# EAGLE design ultimate_Co-Op_v1_0 (EAGLE 7.4.0)
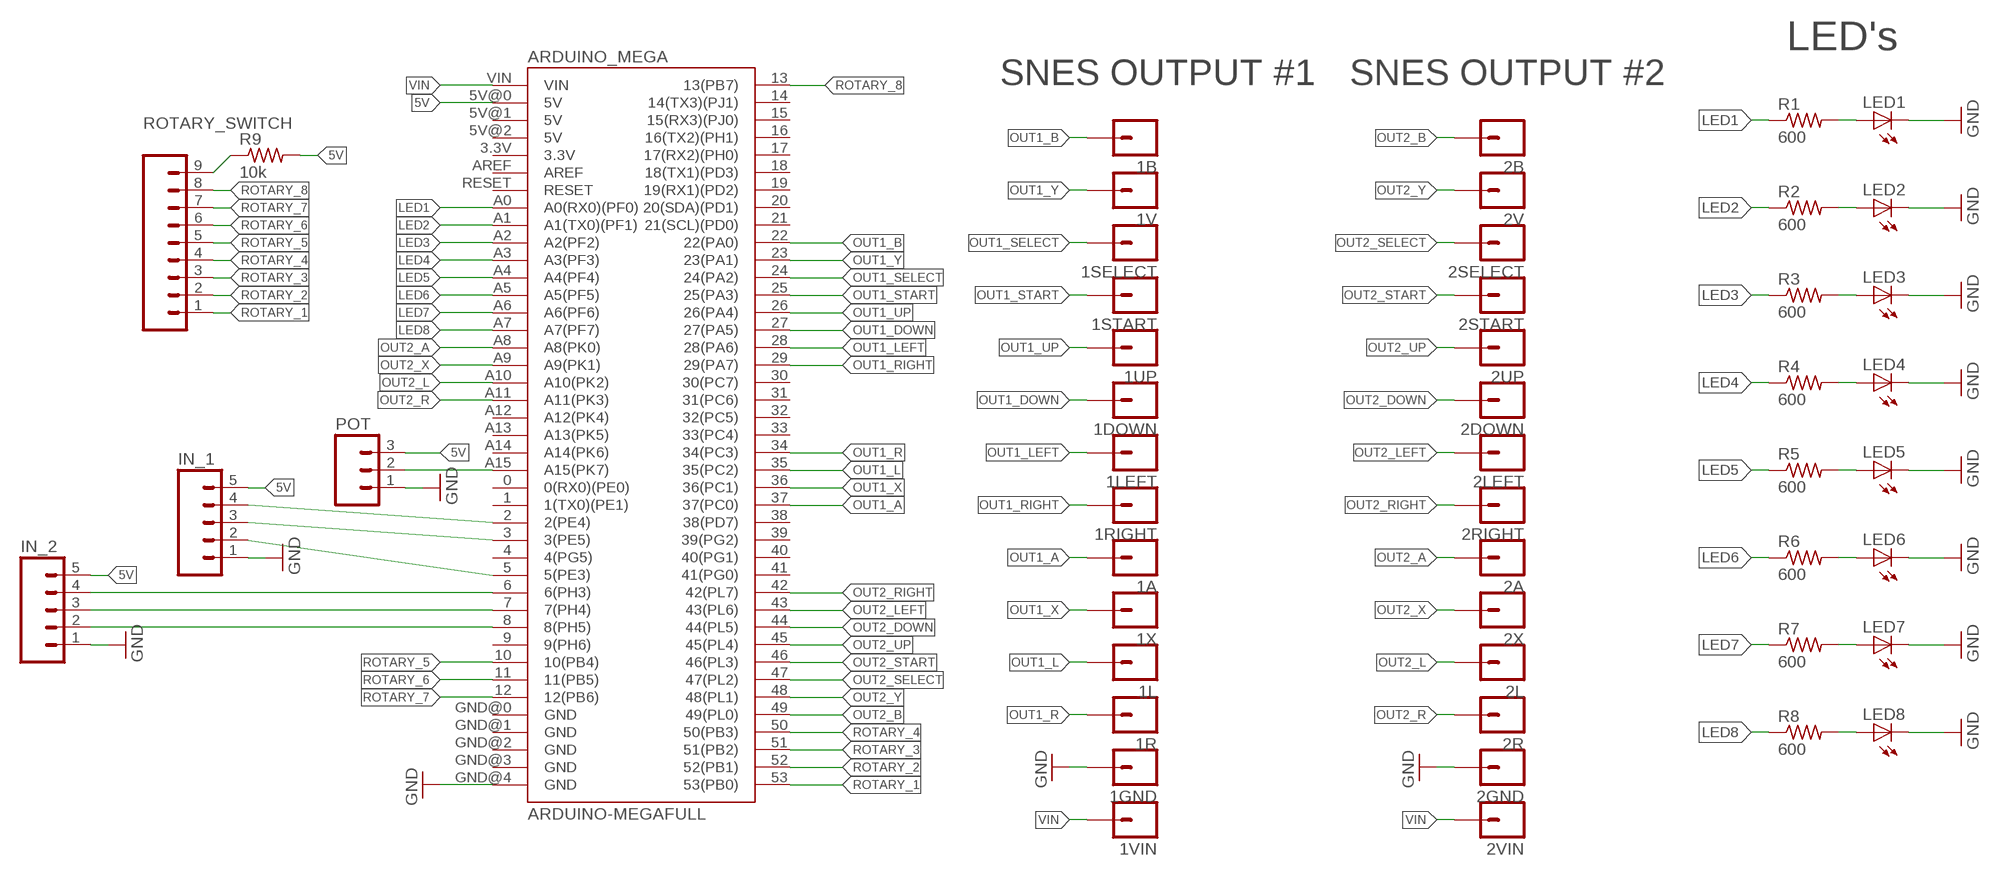
[diagram p0: schematic, sheet 1]

## Parts
1A  M01PTH  [1X01]
1B  M01PTH  [1X01]
1DOWN  M01PTH  [1X01]
1GND  M01PTH  [1X01]
1L  M01PTH  [1X01]
1LEFT  M01PTH  [1X01]
1R  M01PTH  [1X01]
1RIGHT  M01PTH  [1X01]
1SELECT  M01PTH  [1X01]
1START  M01PTH  [1X01]
1UP  M01PTH  [1X01]
1V  M01PTH  [1X01]
1VIN  M01PTH  [1X01]
1X  M01PTH  [1X01]
2A  M01PTH  [1X01]
2B  M01PTH  [1X01]
2DOWN  M01PTH  [1X01]
2GND  M01PTH  [1X01]
2L  M01PTH  [1X01]
2LEFT  M01PTH  [1X01]
2R  M01PTH  [1X01]
2RIGHT  M01PTH  [1X01]
2SELECT  M01PTH  [1X01]
2START  M01PTH  [1X01]
2UP  M01PTH  [1X01]
2V  M01PTH  [1X01]
2VIN  M01PTH  [1X01]
2X  M01PTH  [1X01]
ARDUINO_MEGA  ARDUINO-MEGAFULL  [ARDUINO_MEGA]
IN_1  M05PTH  [1X05]
IN_2  M05PTH  [1X05]
LED1  LED5MM  [LED5MM]
LED2  LED5MM  [LED5MM]
LED3  LED5MM  [LED5MM]
LED4  LED5MM  [LED5MM]
LED5  LED5MM  [LED5MM]
LED6  LED5MM  [LED5MM]
LED7  LED5MM  [LED5MM]
LED8  LED5MM  [LED5MM]
POT  M03LONGPADS  [1X03_LONGPADS]
R1  600  R-US_0204/7  [0204/7]
R2  600  R-US_0204/7  [0204/7]
R3  600  R-US_0204/7  [0204/7]
R4  600  R-US_0204/7  [0204/7]
R5  600  R-US_0204/7  [0204/7]
R6  600  R-US_0204/7  [0204/7]
R7  600  R-US_0204/7  [0204/7]
R8  600  R-US_0204/7  [0204/7]
R9  10k  R-US_0204/7  [0204/7]
ROTARY_SWITCH  M09  [1X09]

## Nets
5V: ARDUINO_MEGA.5V@0(5V) IN_1.5 IN_2.5 POT.3 R9.2
GND: 1GND.1 2GND.1 ARDUINO_MEGA.GND@4(GND) IN_1.1 IN_2.1 LED1.K(C) LED2.K(C) LED3.K(C) LED4.K(C) LED5.K(C) LED6.K(C) LED7.K(C) LED8.K(C) POT.1
LED1: ARDUINO_MEGA.A0(A0(RX0)(PF0)) R1.1
LED2: ARDUINO_MEGA.A1(A1(TX0)(PF1)) R2.1
LED3: ARDUINO_MEGA.A2(A2(PF2)) R3.1
LED4: ARDUINO_MEGA.A3(A3(PF3)) R4.1
LED5: ARDUINO_MEGA.A4(A4(PF4)) R5.1
LED6: ARDUINO_MEGA.A5(A5(PF5)) R6.1
LED7: ARDUINO_MEGA.A6(A6(PF6)) R7.1
LED8: ARDUINO_MEGA.A7(A7(PF7)) R8.1
LSJDFKS: ARDUINO_MEGA.6(6(PH3)) IN_2.4
N$1: LED1.A R1.2
N$2: LED2.A R2.2
N$3: LED3.A R3.2
N$4: LED4.A R4.2
N$5: LED5.A R5.2
N$6: LED6.A R6.2
N$7: LED7.A R7.2
N$8: LED8.A R8.2
N$9: ARDUINO_MEGA.2(2(PE4)) IN_1.4
N$10: ARDUINO_MEGA.3(3(PE5)) IN_1.3
N$11: ARDUINO_MEGA.5(5(PE3)) IN_1.2
N$13: ARDUINO_MEGA.7(7(PH4)) IN_2.3
N$14: ARDUINO_MEGA.8(8(PH5)) IN_2.2
OIJNENLK: R9.1 ROTARY_SWITCH.9
OUT1_A: 1A.1 ARDUINO_MEGA.37(37(PC0))
OUT1_B: 1B.1 ARDUINO_MEGA.22(22(PA0))
OUT1_DOWN: 1DOWN.1 ARDUINO_MEGA.27(27(PA5))
OUT1_L: 1L.1 ARDUINO_MEGA.35(35(PC2))
OUT1_LEFT: 1LEFT.1 ARDUINO_MEGA.28(28(PA6))
OUT1_R: 1R.1 ARDUINO_MEGA.34(34(PC3))
OUT1_RIGHT: 1RIGHT.1 ARDUINO_MEGA.29(29(PA7))
OUT1_SELECT: 1SELECT.1 ARDUINO_MEGA.24(24(PA2))
OUT1_START: 1START.1 ARDUINO_MEGA.25(25(PA3))
OUT1_UP: 1UP.1 ARDUINO_MEGA.26(26(PA4))
OUT1_X: 1X.1 ARDUINO_MEGA.36(36(PC1))
OUT1_Y: 1V.1 ARDUINO_MEGA.23(23(PA1))
OUT2_A: 2A.1 ARDUINO_MEGA.A8(A8(PK0))
OUT2_B: 2B.1 ARDUINO_MEGA.49(49(PL0))
OUT2_DOWN: 2DOWN.1 ARDUINO_MEGA.44(44(PL5))
OUT2_L: 2L.1 ARDUINO_MEGA.A10(A10(PK2))
OUT2_LEFT: 2LEFT.1 ARDUINO_MEGA.43(43(PL6))
OUT2_R: 2R.1 ARDUINO_MEGA.A11(A11(PK3))
OUT2_RIGHT: 2RIGHT.1 ARDUINO_MEGA.42(42(PL7))
OUT2_SELECT: 2SELECT.1 ARDUINO_MEGA.47(47(PL2))
OUT2_START: 2START.1 ARDUINO_MEGA.46(46(PL3))
OUT2_UP: 2UP.1 ARDUINO_MEGA.45(45(PL4))
OUT2_X: 2X.1 ARDUINO_MEGA.A9(A9(PK1))
OUT2_Y: 2V.1 ARDUINO_MEGA.48(48(PL1))
POT1: ARDUINO_MEGA.A15(A15(PK7)) POT.2
ROTARY_1: ARDUINO_MEGA.53(53(PB0)) ROTARY_SWITCH.1
ROTARY_2: ARDUINO_MEGA.52(52(PB1)) ROTARY_SWITCH.2
ROTARY_3: ARDUINO_MEGA.51(51(PB2)) ROTARY_SWITCH.3
ROTARY_4: ARDUINO_MEGA.50(50(PB3)) ROTARY_SWITCH.4
ROTARY_5: ARDUINO_MEGA.10(10(PB4)) ROTARY_SWITCH.5
ROTARY_6: ARDUINO_MEGA.11(11(PB5)) ROTARY_SWITCH.6
ROTARY_7: ARDUINO_MEGA.12(12(PB6)) ROTARY_SWITCH.7
ROTARY_8: ARDUINO_MEGA.13(13(PB7)) ROTARY_SWITCH.8
VIN: 1VIN.1 2VIN.1 ARDUINO_MEGA.VIN
Unconnected: ARDUINO_MEGA.0(0(RX0)(PE0)) ARDUINO_MEGA.1(1(TX0)(PE1)) ARDUINO_MEGA.3.3V ARDUINO_MEGA.4(4(PG5)) ARDUINO_MEGA.5V@1(5V) ARDUINO_MEGA.5V@2(5V) ARDUINO_MEGA.9(9(PH6)) ARDUINO_MEGA.14(14(TX3)(PJ1)) ARDUINO_MEGA.15(15(RX3)(PJ0)) ARDUINO_MEGA.16(16(TX2)(PH1)) ARDUINO_MEGA.17(17(RX2)(PH0)) ARDUINO_MEGA.18(18(TX1)(PD3)) ARDUINO_MEGA.19(19(RX1)(PD2)) ARDUINO_MEGA.20(20(SDA)(PD1)) ARDUINO_MEGA.21(21(SCL)(PD0)) ARDUINO_MEGA.30(30(PC7)) ARDUINO_MEGA.31(31(PC6)) ARDUINO_MEGA.32(32(PC5)) ARDUINO_MEGA.33(33(PC4)) ARDUINO_MEGA.38(38(PD7)) ARDUINO_MEGA.39(39(PG2)) ARDUINO_MEGA.40(40(PG1)) ARDUINO_MEGA.41(41(PG0)) ARDUINO_MEGA.A12(A12(PK4)) ARDUINO_MEGA.A13(A13(PK5)) ARDUINO_MEGA.A14(A14(PK6)) ARDUINO_MEGA.AREF ARDUINO_MEGA.GND@0(GND) ARDUINO_MEGA.GND@1(GND) ARDUINO_MEGA.GND@2(GND) ARDUINO_MEGA.GND@3(GND) ARDUINO_MEGA.RESET

## Notes on the sheet
- LED's
- SNES OUTPUT #1 | SNES OUTPUT #2

## Library data of the parts
1A 1B 1DOWN 1GND 1L 1LEFT 1R 1RIGHT 1SELECT 1START 1UP 1V 1VIN 1X 2A 2B 2DOWN 2GND 2L 2LEFT 2R 2RIGHT 2SELECT 2START 2UP 2V 2VIN 2X = SparkFun-Connectors:M01: Header 1 Standard 1-pin 0.1" header. Use with straight break away headers (SKU : PRT-00116), right angle break away headers (PRT-00553), swiss pins (PRT-00743), machine pins (PRT-00117), and female headers (PRT-00115). SMTSO-256-ET is a "flush mount" nut for a 4-40 screw. The older package used to be too tight, and did not allow it to sit properly thru the drill hit. The latest (0.165DIA) fits nice and snug.
ARDUINO_MEGA = Nathans-Boards_small_mega:ARDUINO-MEGA: Arduino Mega board footprint
IN_1 IN_2 = SparkFun-Connectors:M05: Header 5 Standard 5-pin 0.1" header. Use with straight break away headers (SKU : PRT-00116), right angle break away headers (PRT-00553), swiss pins (PRT-00743), machine pins (PRT-00117), and female headers (PRT-00115). Molex polarized connector foot print use with SKU : PRT-08230 with associated crimp pins and housings.
LED1-LED8 = adafruit:LED: LED OSRAM: - CHIPLED LG R971, LG N971, LY N971, LG Q971, LY Q971, LO R971, LY R971 LH N974, LH R974 LS Q976, LO Q976, LY Q976 LO Q996 - Hyper CHIPLED LW Q18S LB Q993, LB Q99A, LB R99A - SideLED LS A670, LO A670, LY A670, LG A670, LP A670 LB A673, LV A673, LT A673, LW A673 LH A674 LY A675 LS A676, LA A676, LO A676, LY A676, LW A676 LS A679, LY A679, LG A679 - Hyper Micro SIDELED® LS Y876, LA Y876, LO Y876, LY Y876 LT Y87S - SmartLED LW L88C, LW L88S LB L89C, LB L89S, LG L890 LS L89K, LO L89K, LY L89K LS L896, LA L896, LO L896, LY L896 - TOPLED LS T670, LO T670, LY T670, LG T670, LP T670 LSG T670, LSP T670, LSY T670, LOP T670, LYG T670 LG T671, LOG T671, LSG T671 LB T673, LV T673, LT T673, LW T673 LH T674 LS T676, LA T676, LO T676, LY T676, LB T676, LH T676, LSB T676, LW T676 LB T67C, LV T67C, LT T67C, LS T67K, LO T67K, LY T67K, LW E67C LS E67B, LA E67B, LO E67B, LY E67B, LB E67C, LV E67C, LT E67C LW T67C LS T679, LY T679, LG T679 LS T770, LO T770, LY T770, LG T770, LP T770 LB T773, LV T773, LT T773, LW T773 LH T774 LS E675, LA E675, LY E675, LS T675 LS T776, LA T776, LO T776, LY T776, LB T776 LHGB T686 LT T68C, LB T68C - Hyper Mini TOPLED® LB M676 - Mini TOPLED Santana® LG M470 LS M47K, LO M47K, LY M47K Source: http://www.osram.convergy.de/
POT = SparkFun-Connectors:M03: Header 3 Standard 3-pin 0.1" header. Use with straight break away headers (SKU : PRT-00116), right angle break away headers (PRT-00553), swiss pins (PRT-00743), machine pins (PRT-00117), and female headers (PRT-00115). Molex polarized connector foot print use with SKU : PRT-08232 with associated crimp pins and housings.
R1-R9 = adafruit:R-US_: RESISTOR, American symbol
ROTARY_SWITCH = SparkFun-Connectors:M09: Header 9 Standard 9-pin 0.1" header. Use with straight break away headers (SKU : PRT-00116), right angle break away headers (PRT-00553), swiss pins (PRT-00743), machine pins (PRT-00117), and female headers (PRT-00115).

## Net classes
0 default: width 0.229 mm, drill 0.254 mm, clearance 0.203 mm

## Board
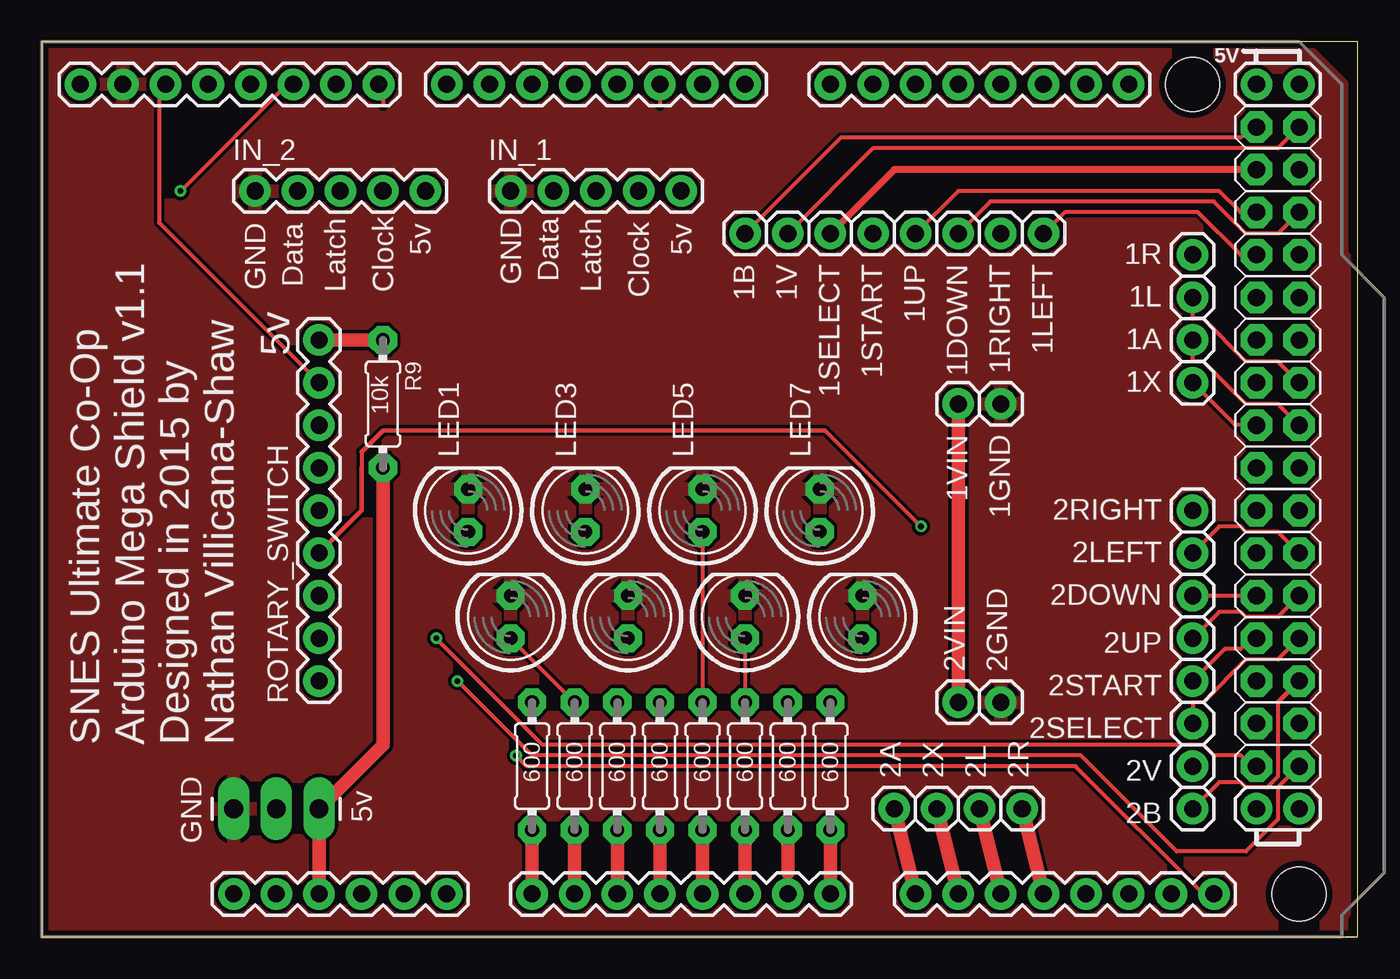
[diagram p1: board, top side]
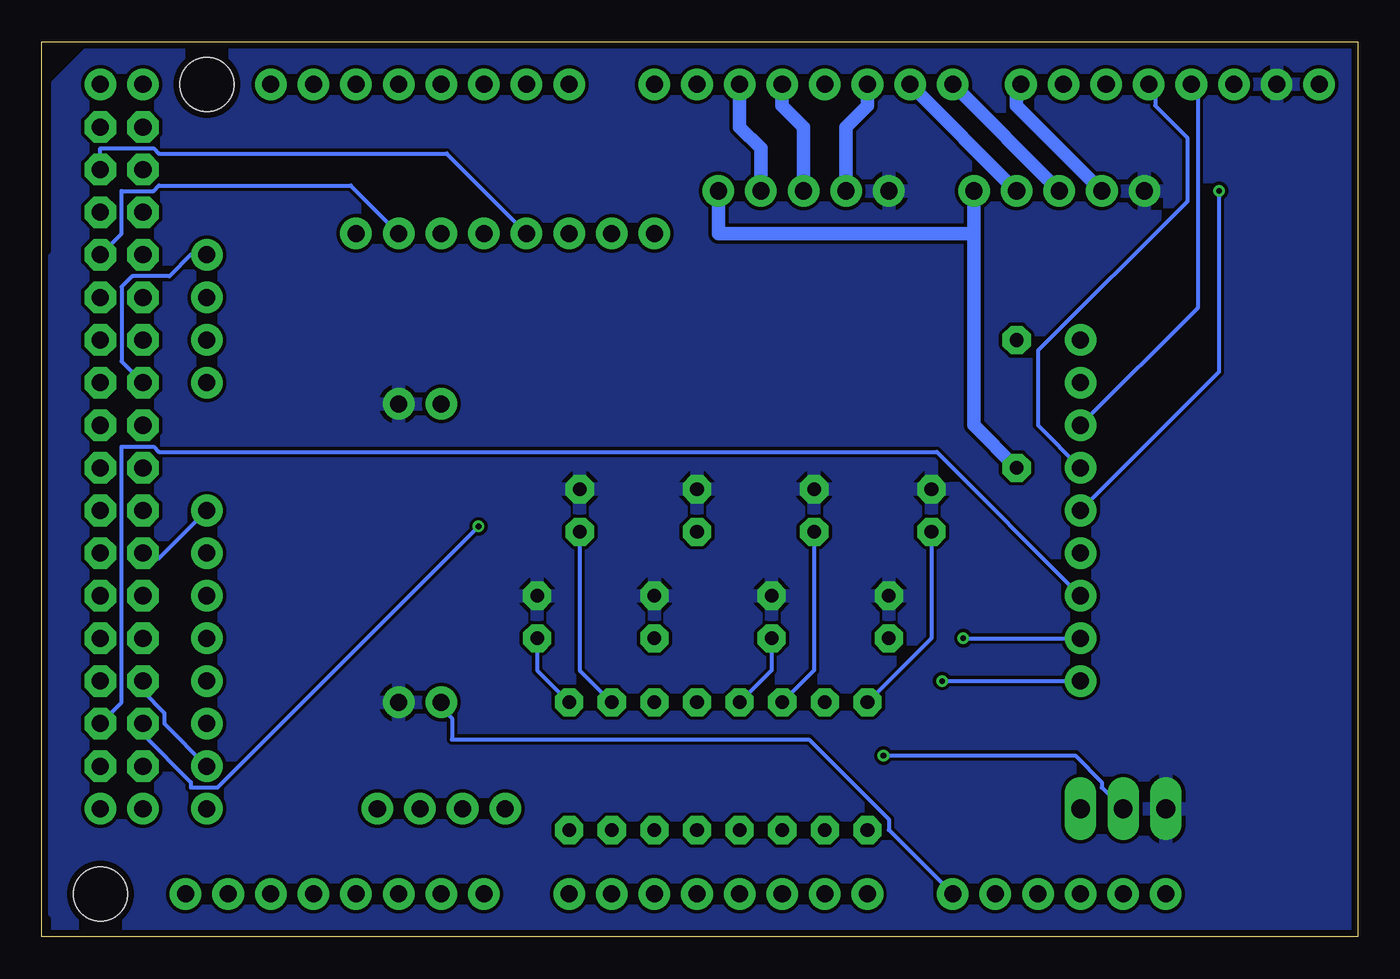
[diagram p2: board, bottom side, seen from below]

Size 78.41 x 53.33 mm. Coordinates in mm from the lower left corner, seen from the top.
Outline: 0,0 78.41,0 78.41,53.33 0,53.33 0,0
Copper layers (1*16): Top 0.0356mm / dielectric 1.5011mm / Bottom 0.0356mm
Design rules "LaenPCBOrder": minimum track width 6mil, minimum drill 13mil, track to track 6mil, track to pad 6mil, pad to pad 6mil, via to via 6mil, smd to smd 6mil, copper to edge 15mil, drill to drill 6mil, minimum pad ring 7mil, minimum via ring 7mil, stop-mask expansion 3mil, vias tented up to drill 0mil, thermal gap 10mil

### Footprints (pad centres in the part's own frame; a part is rotated, then mirrored left to right if it is on the bottom)
1X01 = drill 1.016 pad 1.88: 1 0,0
ARDUINO_MEGA = drill 1.016 pad 1.88: 0 41.91,50.8; 1 39.37,50.8; 2 36.83,50.8; 3 34.29,50.8; 3.3V 13.97,2.54; 4 31.75,50.8; 5 29.21,50.8; 5V@0 16.51,2.54; 5V@1 72.39,50.8; 5V@2 74.93,50.8; 6 26.67,50.8; 7 24.13,50.8; 8 20.066,50.8; 9 17.526,50.8; 10 14.986,50.8; 11 12.446,50.8; 12 9.906,50.8; 13 7.366,50.8; 14 46.99,50.8; 15 49.53,50.8; 16 52.07,50.8; 17 54.61,50.8; 18 57.15,50.8; 19 59.69,50.8; 20 62.23,50.8; 21 64.77,50.8; A0 29.21,2.54; A1 31.75,2.54; A2 34.29,2.54; A3 36.83,2.54; A4 39.37,2.54; A5 41.91,2.54; A6 44.45,2.54; A7 46.99,2.54; A8 52.07,2.54; A9 54.61,2.54; A10 57.15,2.54; A11 59.69,2.54; A12 62.23,2.54; A13 64.77,2.54; A14 67.31,2.54; A15 69.85,2.54; AREF 2.286,50.8; GND@0 19.05,2.54; GND@1 21.59,2.54; GND@2 72.39,7.62; GND@3 74.93,7.62; GND@4 4.826,50.8; RESET 11.43,2.54; VIN 24.13,2.54 | drill 1.016 pad 1.88 octagon: 22 72.39,48.26; 23 74.93,48.26; 24 72.39,45.72; 25 74.93,45.72; 26 72.39,43.18; 27 74.93,43.18; 28 72.39,40.64; 29 74.93,40.64; 30 72.39,38.1; 31 74.93,38.1; 32 72.39,35.56; 33 74.93,35.56; 34 72.39,33.02; 35 74.93,33.02; 36 72.39,30.48; 37 74.93,30.48; 38 72.39,27.94; 39 74.93,27.94; 40 72.39,25.4; 41 74.93,25.4; 42 72.39,22.86; 43 74.93,22.86; 44 72.39,20.32; 45 74.93,20.32; 46 72.39,17.78; 47 74.93,17.78; 48 72.39,15.24; 49 74.93,15.24; 50 72.39,12.7; 51 74.93,12.7; 52 72.39,10.16; 53 74.93,10.16 | hole 3.2: 68.58,50.8; 74.93,2.54
1X05 = drill 1.016 pad 1.88: 1 0,0; 2 2.54,0; 3 5.08,0; 4 7.62,0; 5 10.16,0
LED5MM = drill 0.813 pad 1.676 octagon: A -1.27,0; K 1.27,0
1X03_LONGPADS = drill 1.118 pad 1.88 long: 1 0,0; 2 2.54,0; 3 5.08,0
0204/7 = drill 0.813 pad 1.676 octagon: 1 -3.81,0; 2 3.81,0
1X09 = drill 1.016 pad 1.88: 1 0,0; 2 2.54,0; 3 5.08,0; 4 7.62,0; 5 10.16,0; 6 12.7,0; 7 15.24,0; 8 17.78,0; 9 20.32,0

### Placement (x,y rotation side)
1A  68.58,35.56 180 top
1B  41.91,41.91 270 top
1DOWN  54.61,41.91 270 top
1GND  57.15,31.75 270 top
1L  68.58,38.1 180 top
1LEFT  59.69,41.91 270 top
1R  68.58,40.64 180 top
1RIGHT  57.15,41.91 270 top
1SELECT  46.99,41.91 270 top
1START  49.53,41.91 270 top
1UP  52.07,41.91 270 top
1V  44.45,41.91 270 top
1VIN  54.61,31.75 270 top
1X  68.58,33.02 180 top
2A  50.8,7.62 0 top
2B  68.58,7.62 180 top
2DOWN  68.58,20.32 180 top
2GND  57.15,13.97 0 top
2L  55.88,7.62 0 top
2LEFT  68.58,22.86 180 top
2R  58.42,7.62 0 top
2RIGHT  68.58,25.4 180 top
2SELECT  68.58,12.7 180 top
2START  68.58,15.24 180 top
2UP  68.58,17.78 180 top
2V  68.58,10.16 180 top
2VIN  54.61,13.97 0 top
2X  53.34,7.62 0 top
ARDUINO_MEGA  0,0 0 top
IN_1  27.94,44.45 0 top
IN_2  12.7,44.45 0 top
LED1  25.4,25.4 90 top
LED2  27.94,19.05 90 top
LED3  32.38,25.4 90 top
LED4  34.92,19.05 90 top
LED5  39.37,25.4 90 top
LED6  41.91,19.05 90 top
LED7  46.35,25.4 90 top
LED8  48.9,19.05 90 top
POT  11.43,7.62 0 top
R1  29.21,10.16 90 top
R2  31.75,10.16 90 top
R3  34.29,10.16 90 top
R4  36.83,10.16 90 top
R5  39.37,10.16 90 top
R6  41.91,10.16 90 top
R7  44.45,10.16 90 top
R8  46.99,10.16 90 top
R9  20.32,31.75 270 top
ROTARY_SWITCH  16.51,15.24 90 top

### Tracks (layer width: path | path; a pad name or v marks a point on that pad's centre or on a via)
5V
  Top 0.813: ARDUINO_MEGA.5V@0 POT.3 20.32,11.43 R9.2
  Bottom 0.229: R9.2 20.32,28.57
  Bottom 0.813: R9.2 22.86,30.48 22.86,41.91 | 22.86,41.91 38.1,41.91 IN_1.5 | IN_2.5 22.86,41.91
GND
  pour Top: 0,0 77.47,0 77.47,1.27 80.01,3.81 80.01,38.1 77.47,40.64 77.47,50.8 74.93,53.34 0,53.34
  pour Bottom: 0,53.34 0,0 77.47,0 77.47,1.27 80.01,3.81 80.01,38.1 77.47,40.64 77.47,50.8 74.93,53.34
LED1
  Top 0.813: ARDUINO_MEGA.A0 R1.1
LED2
  Top 0.813: R2.1 ARDUINO_MEGA.A1
LED3
  Top 0.813: R3.1 ARDUINO_MEGA.A2
LED4
  Top 0.813: R4.1 ARDUINO_MEGA.A3
LED5
  Top 0.813: R5.1 ARDUINO_MEGA.A4
LED6
  Top 0.813: R6.1 ARDUINO_MEGA.A5
LED7
  Top 0.229: ARDUINO_MEGA.A6 44.45,3.81
  Top 0.813: R7.1 44.45,3.81
LED8
  Top 0.813: R8.1 ARDUINO_MEGA.A7
LSJDFKS
  Bottom 0.813: ARDUINO_MEGA.6 IN_2.4
N$1
  Bottom 0.229: R1.2 25.4,17.78 LED1.A
N$2
  Top 0.229: LED2.A R2.2
N$3
  Bottom 0.229: R3.2 32.38,15.88 LED3.A
N$4
  Bottom 0.229: R4.2 34.92,15.88 LED4.A
N$5
  Top 0.229: LED5.A R5.2
N$6
  Top 0.229: LED6.A R6.2
N$7
  Bottom 0.229: R7.2 46.35,15.88 LED7.A
N$8
  Bottom 0.229: R8.2 48.9,15.88 LED8.A
N$9
  Top 0.229: ARDUINO_MEGA.2 36.83,49.53
  Bottom 0.813: IN_1.4 35.56,46.99 36.83,48.26 ARDUINO_MEGA.2
N$10
  Bottom 0.813: IN_1.3 33.02,48.26 34.29,49.53 ARDUINO_MEGA.3
N$11
  Bottom 0.813: IN_1.2 30.48,48.26 29.21,49.53 ARDUINO_MEGA.5
N$13
  Bottom 0.813: ARDUINO_MEGA.7 IN_2.3
N$14  (1 unrouted)
  Top 0.229: 20.32,49.53 20.32,50.8 ARDUINO_MEGA.8
  Bottom 0.813: 20.32,50.8 20.32,49.53 IN_2.2
OIJNENLK
  Top 0.813: R9.1 ROTARY_SWITCH.9
OUT1_A
  Top 0.229: 1A.1 68.58,34.29 69.22,34.29 71.75,31.75 73.66,31.75 ARDUINO_MEGA.37
OUT1_B
  Top 0.229: 1B.1 47.62,47.62 71.44,47.62 72.07,48.26 ARDUINO_MEGA.22
OUT1_DOWN
  Top 0.229: 1DOWN.1 56.52,43.81 69.85,43.81 71.75,41.91 73.66,41.91 ARDUINO_MEGA.27
OUT1_L
  Top 0.229: 1L.1 68.58,36.83 69.22,36.83 71.75,34.29 73.66,34.29 ARDUINO_MEGA.35
OUT1_LEFT
  Top 0.229: 1LEFT.1 60.96,43.18 68.9,43.18 71.44,40.64 ARDUINO_MEGA.28
OUT1_R
  Bottom 0.229: ARDUINO_MEGA.34 73.66,34.29 73.66,38.73 73.03,39.37 70.8,39.37 69.53,40.64 1R.1
OUT1_RIGHT
  Bottom 0.229: 1RIGHT.1 60.01,44.77 71.44,44.77 71.75,44.45 73.66,44.45 73.66,41.91 ARDUINO_MEGA.29
OUT1_SELECT
  Top 0.406: ARDUINO_MEGA.24 50.8,45.72 1SELECT.1
OUT1_START
  Bottom 0.229: 1START.1 54.29,46.67 71.44,46.67 71.75,46.99 74.93,46.99 ARDUINO_MEGA.25
OUT1_UP
  Top 0.229: 1UP.1 54.61,44.45 70.17,44.45 71.44,43.18 ARDUINO_MEGA.26
OUT1_X
  Top 0.229: 1X.1 71.12,30.48 ARDUINO_MEGA.36
OUT1_Y
  Top 0.229: 1V.1 49.53,46.99 73.66,46.99 ARDUINO_MEGA.23
OUT2_A
  Top 0.813: ARDUINO_MEGA.A8 2A.1
OUT2_B
  Top 0.229: 2B.1 70.17,9.21 71.44,9.21 71.75,8.89 73.03,8.89 73.66,9.53 73.66,13.97
  Top 0.254: ARDUINO_MEGA.49 73.66,13.97
OUT2_DOWN
  Top 0.229: ARDUINO_MEGA.44 2DOWN.1
OUT2_L
  Top 0.813: ARDUINO_MEGA.A10 2L.1
OUT2_LEFT
  Top 0.229: 2LEFT.1 70.17,24.45 71.44,24.45 71.75,24.13 73.66,24.13 ARDUINO_MEGA.43
OUT2_R
  Top 0.813: 2R.1 ARDUINO_MEGA.A11
OUT2_RIGHT
  Bottom 0.229: 2RIGHT.1 71.44,22.54 72.39,22.54 ARDUINO_MEGA.42
OUT2_SELECT
  Top 0.229: 2SELECT.1 68.58,13.97 69.22,13.97 71.75,16.51 73.66,16.51 ARDUINO_MEGA.47
OUT2_START
  Top 0.229: 2START.1 70.48,17.14 71.44,17.14 72.07,17.78 ARDUINO_MEGA.46
OUT2_UP
  Top 0.229: 2UP.1 70.17,19.37 71.44,19.37 71.75,19.05 73.66,19.05 ARDUINO_MEGA.45
OUT2_X
  Top 0.813: ARDUINO_MEGA.A9 2X.1
OUT2_Y
  Bottom 0.229: 2V.1 71.12,12.7 71.12,13.34 72.39,14.61 ARDUINO_MEGA.48
POT1  (via drill 0.33)
  Top 0.229: v28.26,10.79 28.89,10.16 61.59,10.16 69.22,2.54 ARDUINO_MEGA.A15
  Bottom 0.229: POT.2 15.24,8.89 15.24,9.21 16.83,10.79 v28.26,10.79
ROTARY_1  (via drill 0.33)
  Top 0.229: v24.77,15.24 29.21,10.79 61.91,10.79 67.63,5.08 71.75,5.08 73.66,6.99 73.66,8.89 ARDUINO_MEGA.53
  Bottom 0.229: v24.77,15.24 ROTARY_SWITCH.1
ROTARY_2  (via drill 0.33)
  Top 0.229: v23.5,17.78 29.84,11.43 69.22,11.43 69.85,10.79 71.44,10.79 72.07,10.16 ARDUINO_MEGA.52
  Bottom 0.229: v23.5,17.78 ROTARY_SWITCH.2
ROTARY_3
  Bottom 0.229: ROTARY_SWITCH.3 25.08,28.89 71.44,28.89 71.75,29.21 73.66,29.21 73.66,13.97 ARDUINO_MEGA.51
ROTARY_4  (via drill 0.33)
  Top 0.229: 19.05,28.89 19.05,27.94 19.05,27.3 | v52.39,24.45 46.67,30.16
  Top 0.254: 46.67,30.16 20.32,30.16 19.05,28.89 | 19.05,27.94 19.05,25.4 ROTARY_SWITCH.4
  Bottom 0.229: v52.39,24.45 67.94,8.89 69.53,8.89 69.53,9.21 72.39,12.06 ARDUINO_MEGA.50
ROTARY_5  (via drill 0.33)
  Top 0.229: v8.26,44.45 14.61,50.8 ARDUINO_MEGA.10
  Bottom 0.229: ROTARY_SWITCH.5 8.26,33.66 v8.26,44.45
ROTARY_6
  Bottom 0.229: ROTARY_SWITCH.6 19.05,30.48 19.05,34.92 10.16,43.81 10.16,47.62 12.06,49.53 12.06,50.8 ARDUINO_MEGA.11
ROTARY_7
  Bottom 0.229: ROTARY_SWITCH.7 9.53,37.47 9.53,50.8 ARDUINO_MEGA.12
ROTARY_8
  Top 0.229: ROTARY_SWITCH.8 6.99,42.55 6.99,50.8 ARDUINO_MEGA.13
VIN
  Top 0.813: 2VIN.1 1VIN.1
  Bottom 0.229: ARDUINO_MEGA.VIN 27.94,6.35 27.94,6.99 32.7,11.75 53.98,11.75 53.98,13.02 54.61,13.65 2VIN.1

### Text on the board
tNames: GND | GND | 5v | 5v | Data | Data | Latch | Clock | Latch | Clock | 5v | 10k | SNES Ultimate Co-Op / Arduino Mega Shield v1.1 / Designed in 2015 by / Nathan Villicana-Shaw | 600 | 600 | 600 | 600 | 600 | 600 | 600 | 600 | 5v | GND